# EAGLE design contact (EAGLE 6.5.0)
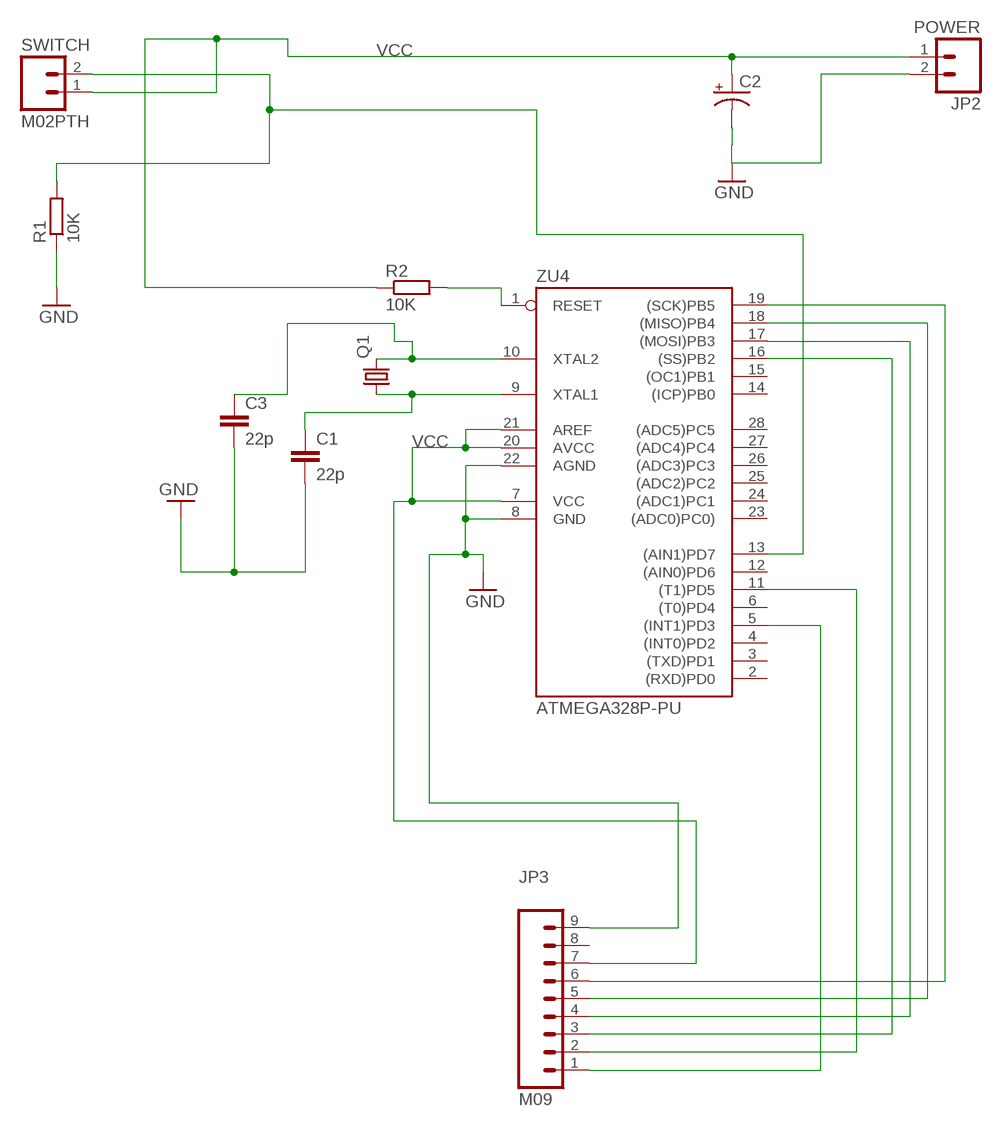
[diagram p0: schematic, sheet 1]

## Parts
C1  22p  C-EU050-025X075  [C050-025X075]
C2  CAP_POLPTH1  [CPOL-RADIAL-100UF-25V]
C3  22p  C-EU050-025X075  [C050-025X075]
JP2  POWER  M02PTH  [1X02]
JP3  M09  [1X09]
Q1  CRYSTALHC49S  [HC49/S]
R1  10K  R-EU_0207/7  [0207/7]
R2  10K  R-EU_0207/7  [0207/7]
SWITCH  M02PTH  [1X02]
ZU4  ATMEGA328P-PU  [DIL28-3]

## Nets
GND [gnd]: C1.2 C2.2(-) C3.2 JP2.2 JP3.9 R1.1 ZU4.8(GND) ZU4.22(AGND)
N$1: JP3.2 ZU4.11((T1)PD5)
N$2: JP3.1 ZU4.5((INT1)PD3)
N$3: R2.2 ZU4.1(RESET)
N$4: C1.1 Q1.1 ZU4.9(XTAL1)
N$5: JP3.6 ZU4.19((SCK)PB5)
N$6: JP3.3 ZU4.16((SS)PB2)
N$19: JP3.5 ZU4.18((MISO)PB4)
N$20: JP3.4 ZU4.17((MOSI)PB3)
N$26: R1.2 SWITCH.2 ZU4.13((AIN1)PD7)
VCC [usbvcc]: C2.1(+) JP2.1 JP3.7 R2.1 SWITCH.1 ZU4.7(VCC) ZU4.20(AVCC) ZU4.21(AREF)
XTAL2: C3.1 Q1.2 ZU4.10(XTAL2)
Unconnected: JP3.8 ZU4.2((RXD)PD0) ZU4.3((TXD)PD1) ZU4.4((INT0)PD2) ZU4.6((T0)PD4) ZU4.12((AIN0)PD6) ZU4.14((ICP)PB0) ZU4.15((OC1)PB1) ZU4.23((ADC0)PC0)) ZU4.24((ADC1)PC1) ZU4.25((ADC2)PC2) ZU4.26((ADC3)PC3) ZU4.27((ADC4)PC4) ZU4.28((ADC5)PC5)

## Library data of the parts
C1 C3 = resistor:C-EU: CAPACITOR, European symbol
C2 = SparkFun-Passives:CAP_POL: Capacitor Polarized These are standard SMD and PTH capacitors. Normally 10uF, 47uF, and 100uF in electrolytic and tantalum varieties. Always verify the external diameter of the through hole cap, it varies with capacity, voltage, and manufacturer. The EIA devices should be standard.
JP2 SWITCH = SparkFun-Connectors:M02: Standard 2-pin 0.1" header. Use with - straight break away headers ( PRT-00116) - right angle break away headers (PRT-00553) - swiss pins (PRT-00743) - machine pins (PRT-00117) - female headers (PRT-00115) Molex polarized connector foot print use with: PRT-08233 with associated crimp pins and housings. 2.54_SCREWTERM for use with PRT-10571. 3.5mm Screw Terminal footprints for PRT-08084 5mm Screw Terminal footprints for use with PRT-08433
JP3 = SparkFun-Connectors:M09: Header 9 Standard 9-pin 0.1" header. Use with straight break away headers (SKU : PRT-00116), right angle break away headers (PRT-00553), swiss pins (PRT-00743), machine pins (PRT-00117), and female headers (PRT-00115).
Q1 = crystal:CRYSTAL: CRYSTAL; OC_FARNELL: 1667008; OC_NEWARK: unknown
R1 R2 = resistor:R-EU_: RESISTOR, European symbol
ZU4 = SmartPrj:ATMEGA328P-: MICROCONTROLLER 4 Kbytes FLASH 128 bytes SRAM 256 bytes EEPROM UART 6-channel 10 bit ADC

## Net classes
0 default: width 0.152 mm, clearance 0.152 mm
1 power: width 0.61 mm, drill 0.61 mm, clearance 0.254 mm
2 gnd: width 0.203 mm, drill 0.559 mm, clearance 0.152 mm
3 usbvcc: width 0.203 mm, drill 0.61 mm, clearance 0.152 mm
4 aref: width 0.406 mm, drill 0.61 mm, clearance 0.254 mm

## Board
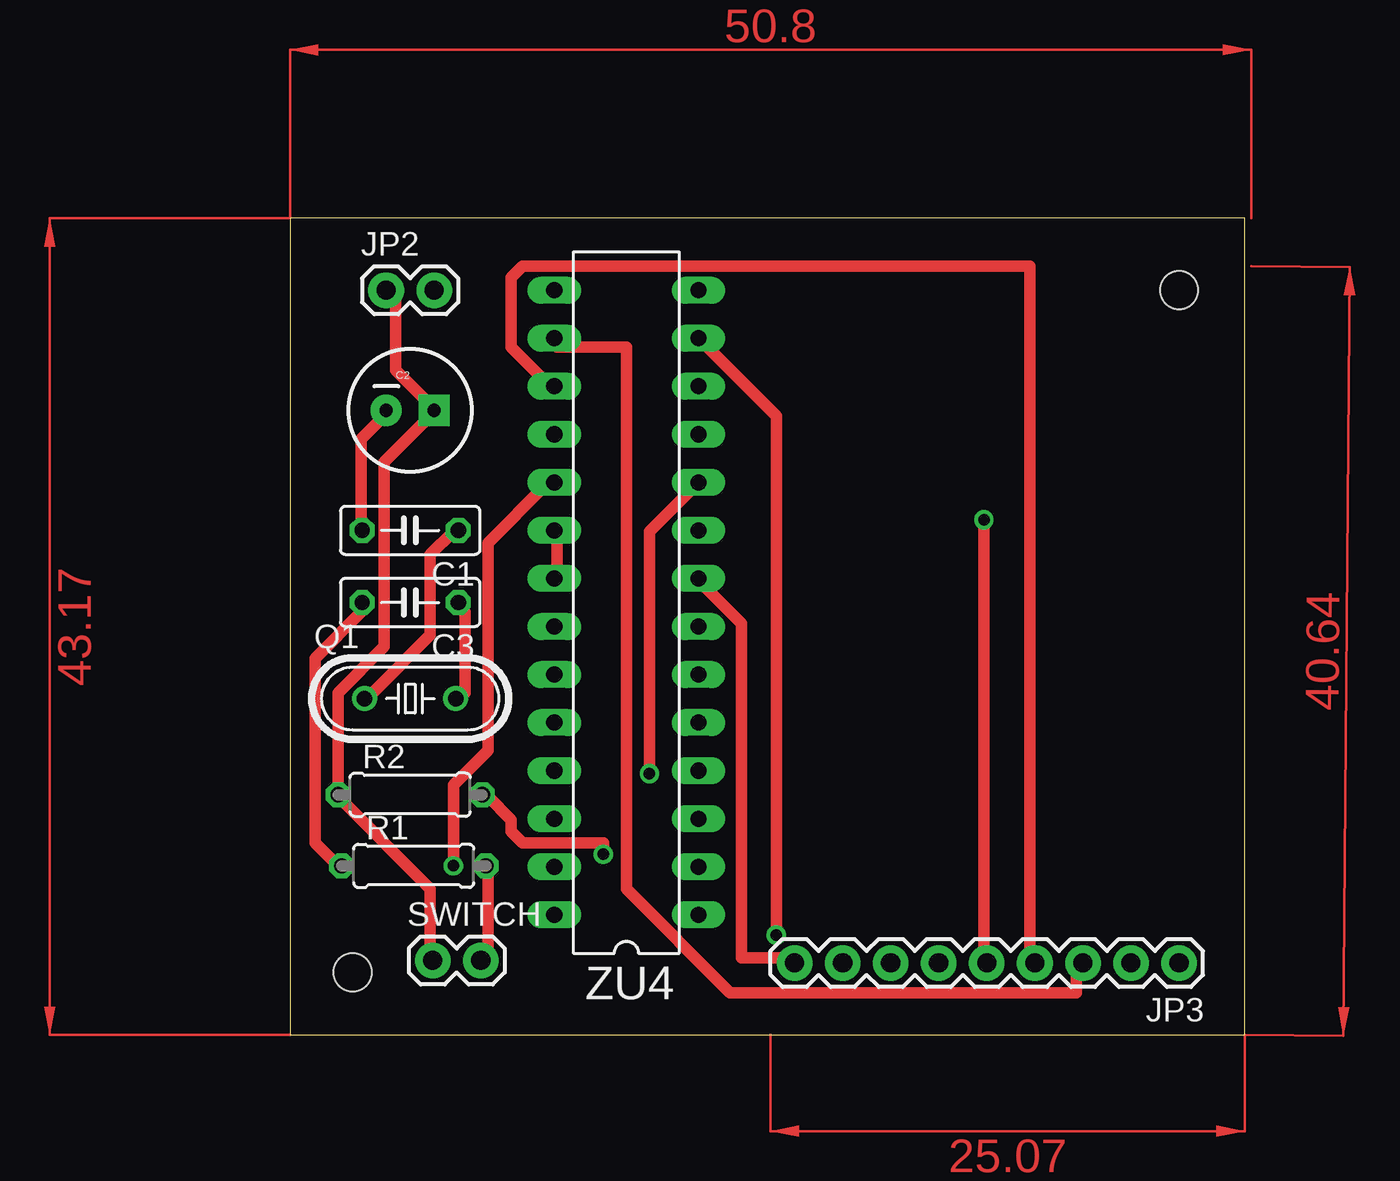
[diagram p1: board, top side]
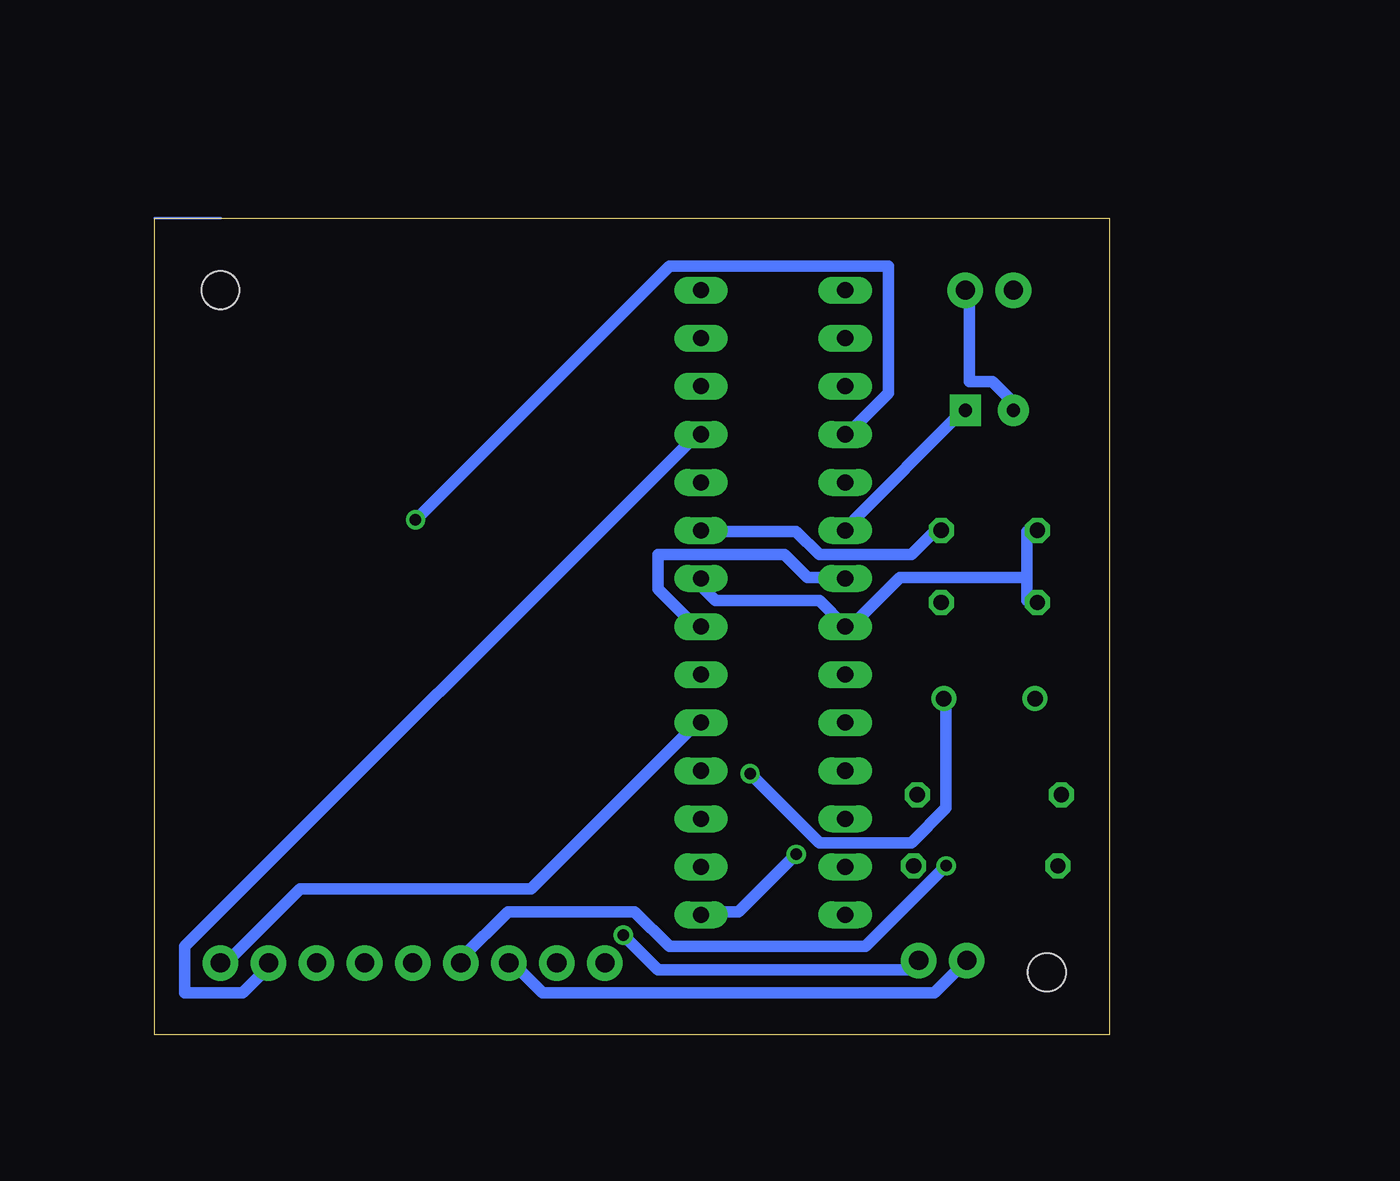
[diagram p2: board, bottom side, seen from below]

Size 50.47 x 43.17 mm. Coordinates in mm from the lower left corner, seen from the top.
Outline: 0,0 50.47,0 50.47,43.17 0,43.17 0,0
Copper layers (1*16): Top 0.035mm / dielectric 1.5mm / Bottom 0.035mm
Design rules "default *": minimum track width 24mil, minimum drill 24mil, track to track 10mil, track to pad 8mil, pad to pad 8mil, via to via 8mil, smd to smd 8mil, copper to edge 40mil, drill to drill 8mil, minimum pad ring 10mil, minimum via ring 8mil, stop-mask expansion 4mil, vias tented up to drill 0mil, thermal gap 10mil
Holes 2 mm at 46.99,39.37 3.31,3.31

### Footprints (pad centres in the part's own frame; a part is rotated, then mirrored left to right if it is on the bottom)
C050-025X075 = drill 0.813 octagon: 1 -2.54,0; 2 2.54,0
CPOL-RADIAL-100UF-25V = drill 0.7 pad 1.651 square: 1 1.27,0 | drill 0.7 pad 1.651: 2 -1.27,0
1X02 = drill 1.016 pad 1.88: 1 0,0; 2 2.54,0
1X09 = drill 1.016 pad 1.88: 1 0,0; 2 2.54,0; 3 5.08,0; 4 7.62,0; 5 10.16,0; 6 12.7,0; 7 15.24,0; 8 17.78,0; 9 20.32,0
HC49/S = drill 0.813: 1 -2.413,0; 2 2.413,0
0207/7 = drill 0.813 octagon: 1 -3.81,0; 2 3.81,0
DIL28-3 = drill 0.85 pad 1.422 long: 1 -16.51,-3.81; 2 -13.97,-3.81; 3 -11.43,-3.81; 4 -8.89,-3.81; 5 -6.35,-3.81; 6 -3.81,-3.81; 7 -1.27,-3.81; 8 1.27,-3.81; 9 3.81,-3.81; 10 6.35,-3.81; 11 8.89,-3.81; 12 11.43,-3.81; 13 13.97,-3.81; 14 16.51,-3.81; 15 16.51,3.81; 16 13.97,3.81; 17 11.43,3.81; 18 8.89,3.81; 19 6.35,3.81; 20 3.81,3.81; 21 1.27,3.81; 22 -1.27,3.81; 23 -3.81,3.81; 24 -6.35,3.81; 25 -8.89,3.81; 26 -11.43,3.81; 27 -13.97,3.81; 28 -16.51,3.81

### Placement (x,y rotation side)
C1  6.35,26.67 180 top
C2  6.35,33.02 0 top
C3  6.35,22.86 180 top
JP2  5.08,39.37 0 top
JP3  46.99,3.81 180 top
Q1  6.35,17.78 0 top
R1  6.54,8.94 0 top
R2  6.35,12.7 0 top
SWITCH  7.54,3.94 0 top
ZU4  17.78,22.86 90 top

### Tracks (layer width: path | path; a pad name or v marks a point on that pad's centre or on a via)
GND
  Top 0.61: R1.1 2.54,8.94 1.32,10.16 1.32,19.91 3.76,22.35 C3.2 | C2.2 4.98,32.72 3.76,31.5 3.76,27.23 C1.2 | JP3.9 26.31,4.06 23.88,4.06 23.88,21.74 22.05,23.57 ZU4.8
  Bottom 0.61: 4.37,24.18 4.37,22.96 C3.2 | 4.37,24.18 4.37,26.62 C1.2 | 4.37,24.18 11.07,24.18 13.51,21.74 ZU4.22 15.34,22.96 20.83,22.96 21.44,23.57 ZU4.8 | JP2.2 7.42,38.81 7.42,34.54 6.2,34.54 4.98,33.33 C2.2
N$1
  Bottom 0.61: ZU4.11 22.05,31.5 48.87,4.67 48.87,2.23 45.82,2.23 44.6,3.45 JP3.2
N$2
  Bottom 0.61: ZU4.5 22.05,16.26 30.58,7.72 42.77,7.72 46.43,4.06 JP3.1
N$3  (via drill 0.61)
  Top 0.61: v16.56,9.55 16.56,10.16 12.29,10.16 11.68,10.77 11.68,11.38 10.46,12.6 R2.2
  Bottom 0.61: v16.56,9.55 19.61,6.5 21.44,6.5 ZU4.1
N$4
  Top 0.61: Q1.1 4.37,18.09 7.42,21.13 7.42,25.4 8.64,26.62 C1.1
  Bottom 0.61: ZU4.9 21.44,26.62 16.56,26.62 15.34,25.4 10.46,25.4 9.25,26.62 C1.1
N$5  (via drill 0.61)
  Top 0.61: v8.64,8.94 8.64,13.21 10.46,15.04 10.46,26.01 13.51,29.06 ZU4.19
  Bottom 0.61: v8.64,8.94 12.9,4.67 23.27,4.67 25.09,6.5 31.8,6.5 34.24,4.06 JP3.6
N$6
  Top 0.61: ZU4.16 14.12,36.37 17.78,36.37 17.78,7.72 23.27,2.23 41.55,2.23 41.55,3.45 JP3.3
N$19  (via drill 0.61)
  Top 0.61: v36.68,27.23 36.68,4.06 JP3.5
  Bottom 0.61: v36.68,27.23 23.27,40.64 11.68,40.64 11.68,33.93 13.51,32.11 ZU4.18
N$20
  Top 0.61: ZU4.17 13.51,34.54 11.68,36.37 11.68,40.03 12.29,40.64 39.12,40.64 39.12,4.06 JP3.4
N$26  (via drill 0.61)
  Top 0.61: R1.2 10.46,8.33 10.46,4.06 SWITCH.2 | ZU4.13 25.7,32.72 v25.7,5.28
  Bottom 0.61: v25.7,5.28 23.88,3.45 10.46,3.45 SWITCH.2
VCC
  Top 0.61: JP2.1 5.59,38.81 5.59,35.15 7.42,33.33 C2.1 7.42,32.72 4.98,30.28 4.98,20.52 2.54,18.09 R2.1 2.54,12.6 7.42,7.72 7.42,4.06 SWITCH.1 | ZU4.21 14.12,24.18 14.12,26.62 ZU4.20
  Bottom 0.61: ZU4.7 22.05,21.74 23.88,23.57 23.88,25.4 17.17,25.4 15.95,24.18 14.12,24.18 ZU4.21 | C2.1 8.03,32.72 13.51,27.23 ZU4.20 | JP3.7 31.19,3.45 29.97,2.23 9.25,2.23 8.03,3.45 SWITCH.1
XTAL2  (via drill 0.61)
  Top 0.61: Q1.2 9.25,18.09 9.25,22.35 C3.1 | ZU4.10 19,26.62 v19,13.82
  Bottom 0.61: v19,13.82 15.34,10.16 10.46,10.16 8.64,11.99 8.64,17.47 Q1.2
(copper drawn outside any net)
  shapes: Bottom area x1, Top area x4